# EAGLE board MA-DAQ (EAGLE 5.11), part 1 of 2
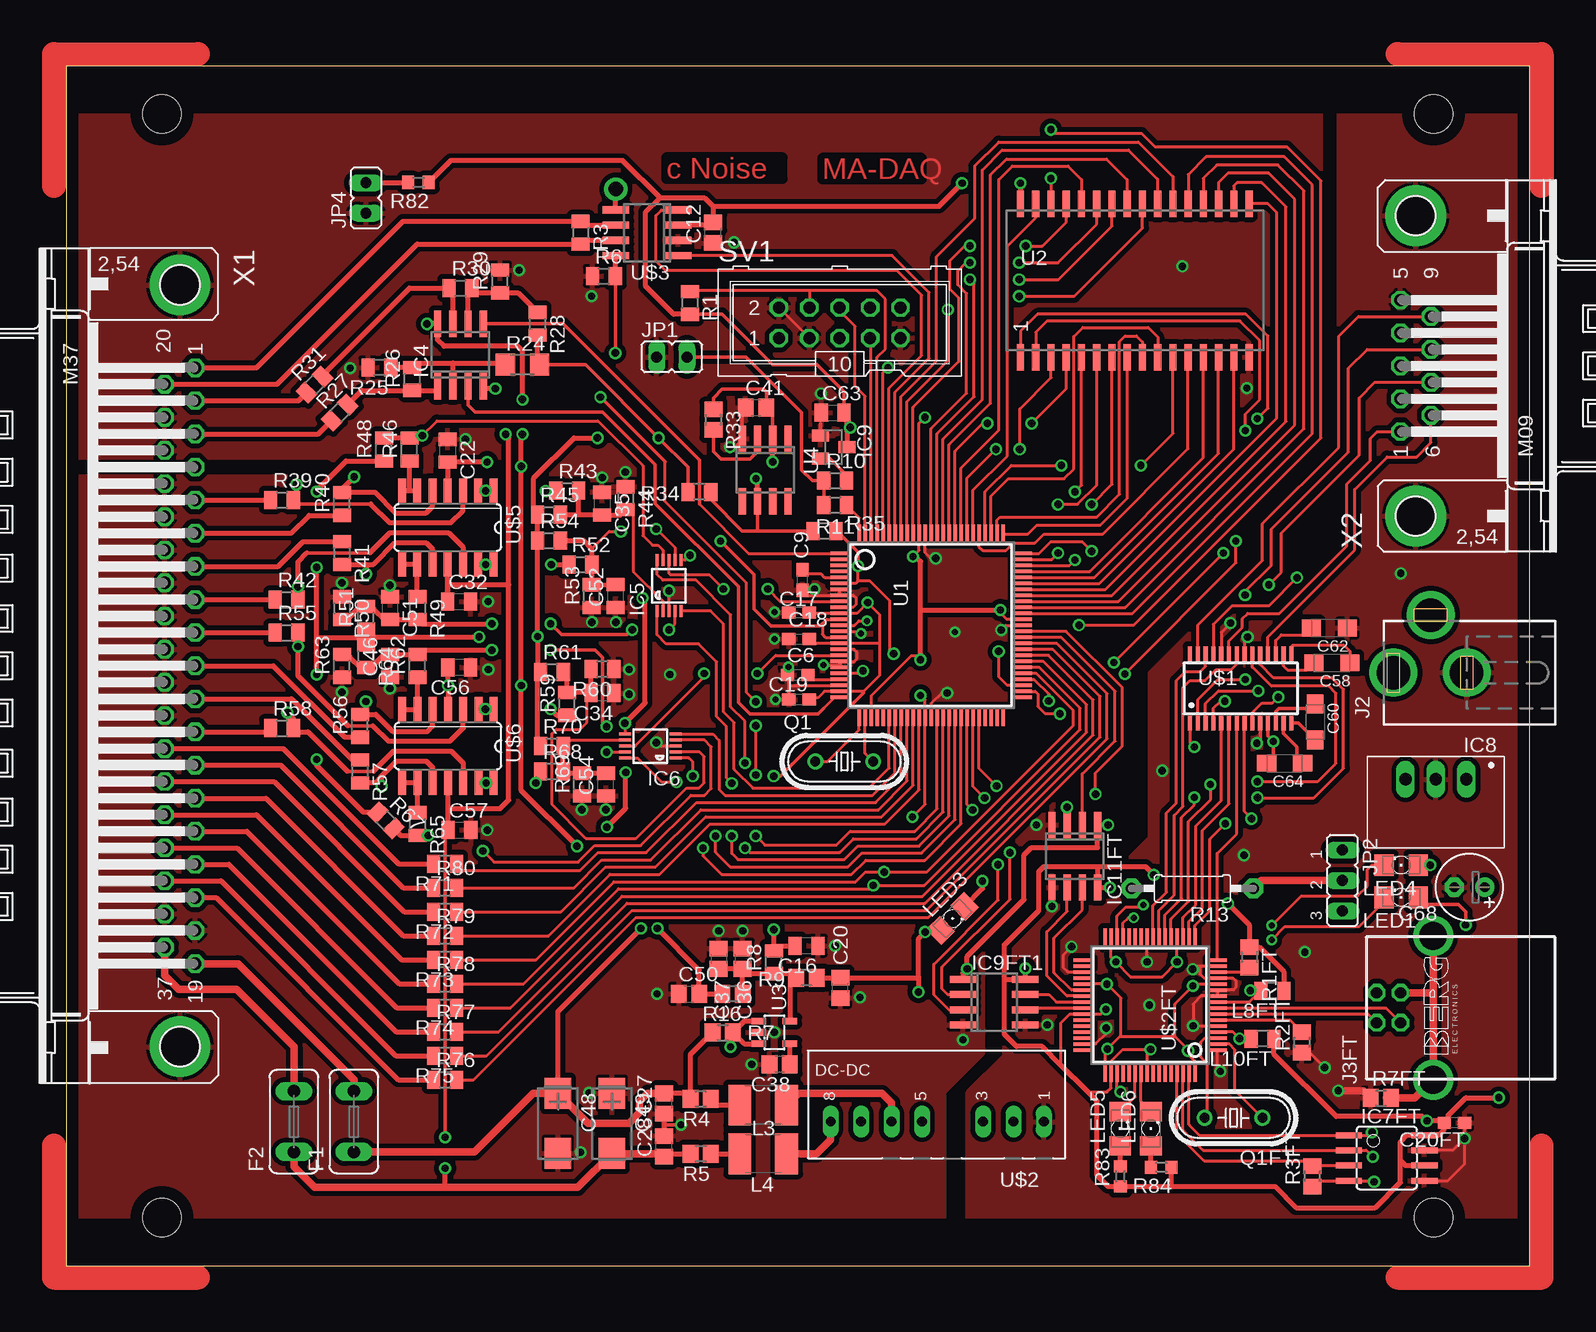
[diagram p5: board, top side]
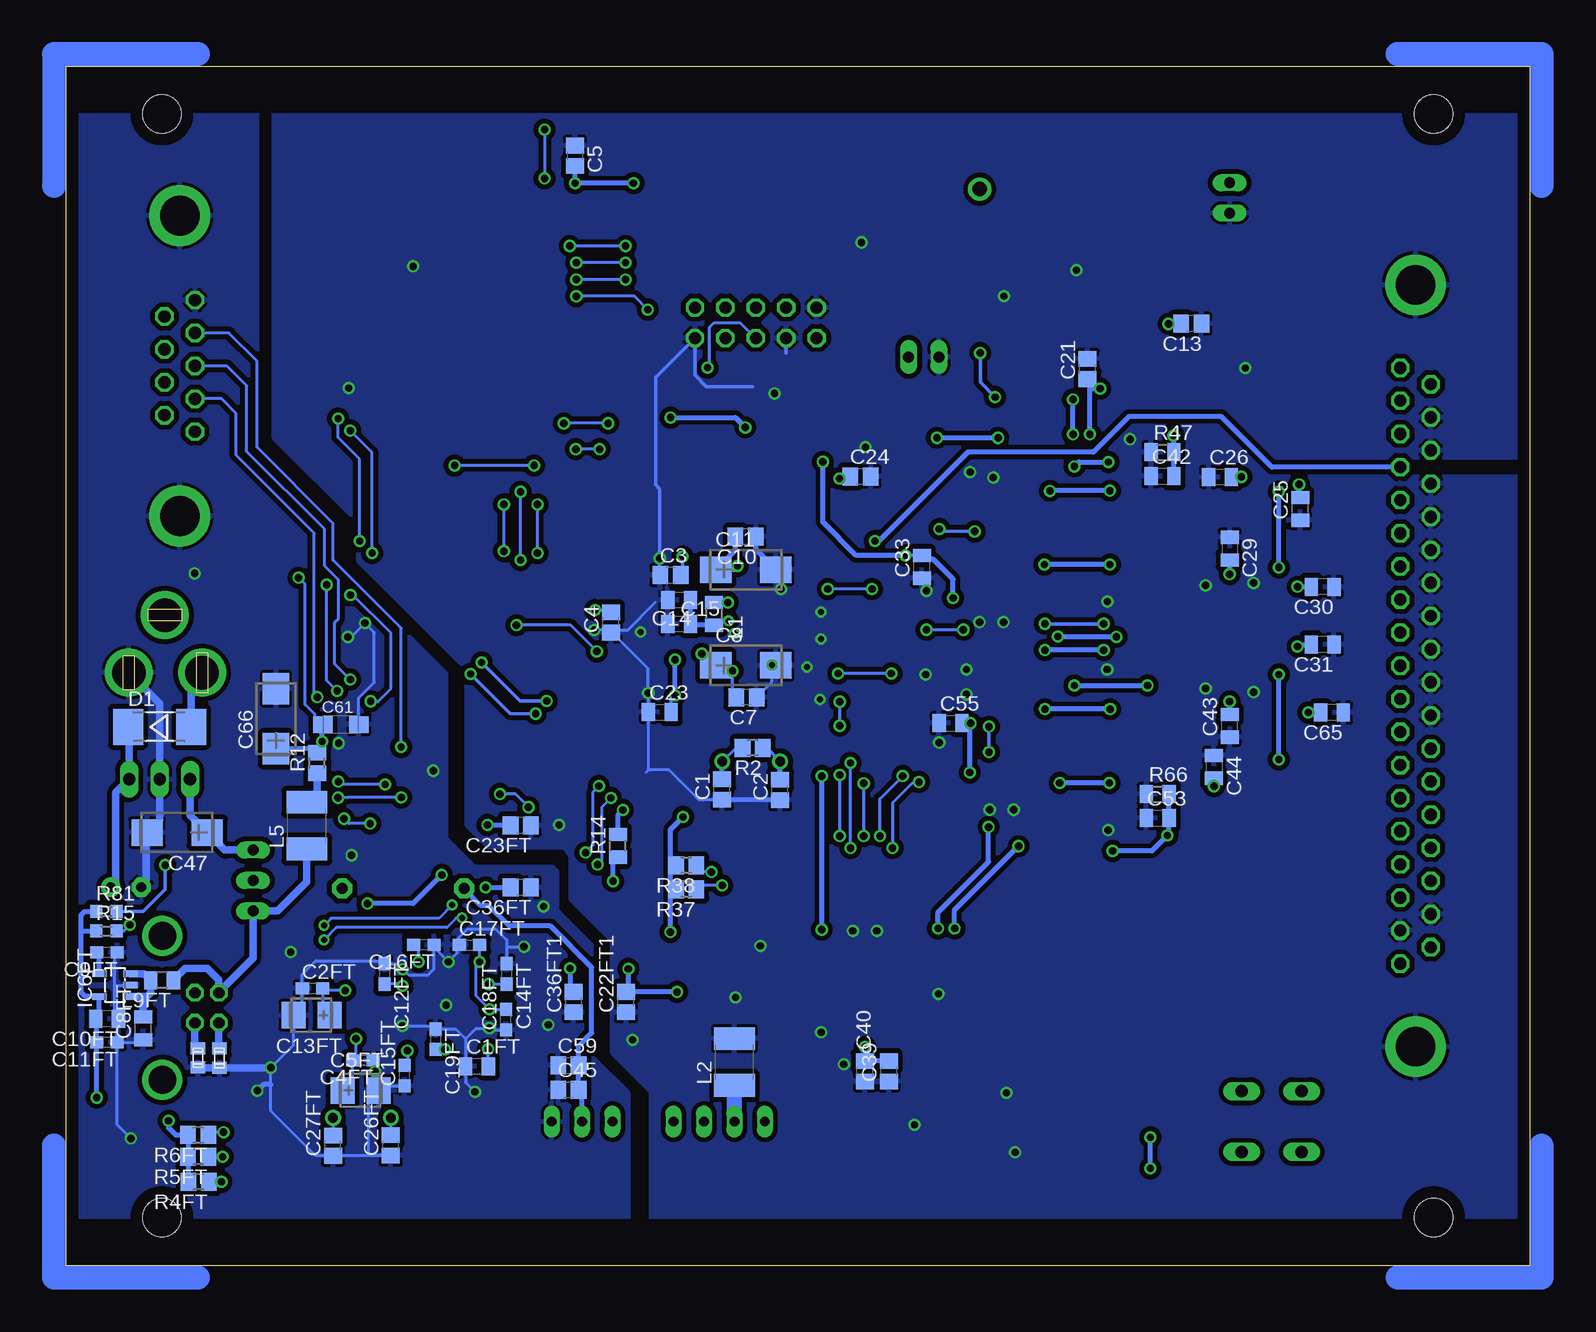
[diagram p6: board, bottom side, seen from below]

Size 122 x 100 mm. Coordinates in mm from the lower left corner, seen from the top.
Outline: 0,0 122,0 122,100 0,100 0,0
Copper layers (1*16): Top 0.035mm / dielectric 1.5mm / Bottom 0.035mm
Design rules "default *": minimum track width 10mil, minimum drill 15mil, track to track 8mil, track to pad 8mil, pad to pad 7mil, via to via 8mil, smd to smd 0mil, copper to edge 40mil, drill to drill 8mil, minimum pad ring 10mil, minimum via ring 8mil, stop-mask expansion 4mil, vias tented up to drill 0mil, thermal gap 10mil
Holes 3.2 mm at 8,4 114,4 8,96 114,96
tRestrict: area 0,0 to 122,3.5; area 0,96.5 to 122,100; 2 lines
bRestrict: area 0,0 to 122,3.5; area 0,96.5 to 122,100; 2 lines

## Footprints (pad centres in the part's own frame; a part is rotated, then mirrored left to right if it is on the bottom)
C0805 = smd 1.3 x 1.5: 1 -0.85,0; 2 0.85,0
C0805' = smd 1.1 x 1.5: 1 -0.95,0; 2 0.95,0
C0603 = smd 1.1 x 1: 1 -0.85,0; 2 0.85,0
CT3528 = smd 2 x 2.2: + -1.5,0; - 1.5,0
CT6032 = smd 2.6 x 2.2: + -2.5,0; - 2.5,0
SMC_A = smd 1.6 x 1.4: + -1.5,0; - 1.5,0
E2,5-6 = drill 0.813 pad 1.6 round: + -1.27,0 | drill 0.813 pad 1.6 octagon: - 1.27,0
MELF-MLL41 = smd 2.5 x 3: A 2.625,0; C -2.625,0
TE5 = drill 1.016 long: 1 -2.54,0; 2 2.54,0
SO08 = smd 0.6 x 2.2: 1 -1.905,-2.6; 2 -0.635,-2.6; 3 0.635,-2.6; 4 1.905,-2.6; 5 1.905,2.6; 6 0.635,2.6; 7 -0.635,2.6; 8 -1.905,2.6
MSOP10 = smd 0.25 x 1: 1 -1,-2.113; 2 -0.5,-2.113; 3 0,-2.113; 4 0.5,-2.113; 5 1,-2.113; 6 1,2.113; 7 0.5,2.113; 8 0,2.113; 9 -0.5,2.113; 10 -1,2.113
SOT23-5L = smd 0.55 x 1.2: 1 -0.95,-1.3; 2 0,-1.3; 3 0.95,-1.3; 4 0.95,1.3; 5 -0.95,1.3
SOIC8 = smd 0.5 x 2.2: 1 -1.905,-3.154; 2 -0.645,-3.154; 3 0.625,-3.154; 4 1.895,-3.154; 5 1.905,3.154; 6 0.635,3.154; 7 -0.635,3.154; 8 -1.905,3.154
R-78XX-0.5 = drill 1.016 long: GND 0,-2.54; IN -2.54,-2.54; OUT 2.54,-2.54
SOT23B-3 = smd 1 x 1.4: 1 -0.95,-1.1; 2 0.95,-1.1; 3 0,1.1
DC_POWER_JACK = drill 2.8 pad 4 round: 1 0,3.1; 2 4.8,0; 3 0,-3
USBCONNB = drill 0.95 octagon: 1 1.25,4.71; 2 -1.25,4.71; 3 -1.25,2.71; 4 1.25,2.71 | drill 2.3 round: CASE@1 -6,0; CASE@2 6,0
JP1 = drill 0.914 long: 1 0,-1.27; 2 0,1.27
JP2 = drill 0.914 long: 1 -2.54,0; 2 0,0; 3 2.54,0
R0805 = smd 1.1 x 1.5: 1 -0.95,0; 2 0.95,0
L1812 = smd 1.9 x 3.4: 1 -1.95,0; 2 1.95,0
1206 = smd 1.6 x 1.803: A -1.422,0; C 1.422,0
HC49/S = drill 0.813 round: 1 -2.413,0; 2 2.413,0
R0805' = smd 1.3 x 1.5: 1 -0.85,0; 2 0.85,0
0207/10 = drill 0.9 pad 1.676 octagon: 1 -5.08,0; 2 5.08,0
R0603 = smd 1 x 1.1: 1 -0.85,0; 2 0.85,0
R1206 = smd 1.6 x 1.803: 1 -1.422,0; 2 1.422,0
ML10 = drill 1 octagon: 1 -5.08,-1.27; 2 -5.08,1.27; 3 -2.54,-1.27; 4 -2.54,1.27; 5 0,-1.27; 6 0,1.27; 7 2.54,-1.27; 8 2.54,1.27; 9 5.08,-1.27; 10 5.08,1.27
TQFP100 = smd 0.3 x 1.6: 1 -6,-7.6; 2 -5.5,-7.6; 3 -5,-7.6; 4 -4.5,-7.6; 5 -4,-7.6; 6 -3.5,-7.6; 7 -3,-7.6; 8 -2.5,-7.6; 9 -2,-7.6; 10 -1.5,-7.6; 11 -1,-7.6; 12 -0.5,-7.6; 13 0,-7.6; 14 0.5,-7.6; 15 1,-7.6; 16 1.5,-7.6; 17 2,-7.6; 18 2.5,-7.6; 19 3,-7.6; 20 3.5,-7.6; 21 4,-7.6; 22 4.5,-7.6; 23 5,-7.6; 24 5.5,-7.6; 25 6,-7.6; 51 6,7.6; 52 5.5,7.6; 53 5,7.6; 54 4.5,7.6; 55 4,7.6; 56 3.5,7.6; 57 3,7.6; 58 2.5,7.6; 59 2,7.6; 60 1.5,7.6; 61 1,7.6; 62 0.5,7.6; 63 0,7.6; 64 -0.5,7.6; 65 -1,7.6; 66 -1.5,7.6; 67 -2,7.6; 68 -2.5,7.6; 69 -3,7.6; 70 -3.5,7.6; 71 -4,7.6; 72 -4.5,7.6; 73 -5,7.6; 74 -5.5,7.6; 75 -6,7.6 | smd 1.6 x 0.3: 26 7.6,-6; 27 7.6,-5.5; 28 7.6,-5; 29 7.6,-4.5; 30 7.6,-4; 31 7.6,-3.5; 32 7.6,-3; 33 7.6,-2.5; 34 7.6,-2; 35 7.6,-1.5; 36 7.6,-1; 37 7.6,-0.5; 38 7.6,0; 39 7.6,0.5; 40 7.6,1; 41 7.6,1.5; 42 7.6,2; 43 7.6,2.5; 44 7.6,3; 45 7.6,3.5; 46 7.6,4; 47 7.6,4.5; 48 7.6,5; 49 7.6,5.5; 50 7.6,6; 76 -7.6,6; 77 -7.6,5.5; 78 -7.6,5; 79 -7.6,4.5; 80 -7.6,4; 81 -7.6,3.5; 82 -7.6,3; 83 -7.6,2.5; 84 -7.6,2; 85 -7.6,1.5; 86 -7.6,1; 87 -7.6,0.5; 88 -7.6,0; 89 -7.6,-0.5; 90 -7.6,-1; 91 -7.6,-1.5; 92 -7.6,-2; 93 -7.6,-2.5; 94 -7.6,-3; 95 -7.6,-3.5; 96 -7.6,-4; 97 -7.6,-4.5; 98 -7.6,-5; 99 -7.6,-5.5; 100 -7.6,-6
SOP32 = smd 0.6 x 2.2: 1 -9.525,-6.4; 2 -8.255,-6.4; 3 -6.985,-6.4; 4 -5.715,-6.4; 5 -4.445,-6.4; 6 -3.175,-6.4; 7 -1.905,-6.4; 8 -0.635,-6.4; 9 0.635,-6.4; 10 1.905,-6.4; 11 3.175,-6.4; 12 4.445,-6.4; 13 5.715,-6.4; 14 6.985,-6.4; 15 8.255,-6.4; 16 9.525,-6.4; 17 9.525,6.4; 18 8.255,6.4; 19 6.985,6.4; 20 5.715,6.4; 21 4.445,6.4; 22 3.175,6.4; 23 1.905,6.4; 24 0.635,6.4; 25 -0.635,6.4; 26 -1.905,6.4; 27 -3.175,6.4; 28 -4.445,6.4; 29 -5.715,6.4; 30 -6.985,6.4; 31 -8.255,6.4; 32 -9.525,6.4
SO8 = smd 0.6 x 2.2: 1 -1.905,-2.6; 2 -0.635,-2.6; 3 0.635,-2.6; 4 1.905,-2.6; 5 1.905,2.6; 6 0.635,2.6; 7 -0.635,2.6; 8 -1.905,2.6
TSSOP28 = smd 0.35 x 1.2: 1 -4.225,-2.9; 2 -3.575,-2.9; 3 -2.925,-2.9; 4 -2.275,-2.9; 5 -1.625,-2.9; 6 -0.975,-2.9; 7 -0.325,-2.9; 8 0.325,-2.9; 9 0.975,-2.9; 10 1.625,-2.9; 11 2.275,-2.9; 12 2.925,-2.9; 13 3.575,-2.9; 14 4.225,-2.9; 15 4.225,2.9; 16 3.575,2.9; 17 2.925,2.9; 18 2.275,2.9; 19 1.625,2.9; 20 0.975,2.9; 21 0.325,2.9; 22 -0.325,2.9; 23 -0.975,2.9; 24 -1.625,2.9; 25 -2.275,2.9; 26 -2.925,2.9; 27 -3.575,2.9; 28 -4.225,2.9
PGB1010603 = smd 1 x 1.2: P$1 -0.8,0; P$2 0.8,0
TMR2P = drill 0.813 long: 1 0,0; 2 2.54,0; 3 5.08,0; 5 10.16,0; 6 12.7,0; 7 15.24,0; 8 17.78,0
SQFP-S-10X10-64 = smd 0.3 x 1.6: 1 -3.75,-5.6; 2 -3.25,-5.6; 3 -2.75,-5.6; 4 -2.25,-5.6; 5 -1.75,-5.6; 6 -1.25,-5.6; 7 -0.75,-5.6; 8 -0.25,-5.6; 9 0.25,-5.6; 10 0.75,-5.6; 11 1.25,-5.6; 12 1.75,-5.6; 13 2.25,-5.6; 14 2.75,-5.6; 15 3.25,-5.6; 16 3.75,-5.6; 33 3.75,5.6; 34 3.25,5.6; 35 2.75,5.6; 36 2.25,5.6; 37 1.75,5.6; 38 1.25,5.6; 39 0.75,5.6; 40 0.25,5.6; 41 -0.25,5.6; 42 -0.75,5.6; 43 -1.25,5.6; 44 -1.75,5.6; 45 -2.25,5.6; 46 -2.75,5.6; 47 -3.25,5.6; 48 -3.75,5.6 | smd 1.6 x 0.3: 17 5.6,-3.75; 18 5.6,-3.25; 19 5.6,-2.75; 20 5.6,-2.25; 21 5.6,-1.75; 22 5.6,-1.25; 23 5.6,-0.75; 24 5.6,-0.25; 25 5.6,0.25; 26 5.6,0.75; 27 5.6,1.25; 28 5.6,1.75; 29 5.6,2.25; 30 5.6,2.75; 31 5.6,3.25; 32 5.6,3.75; 49 -5.6,3.75; 50 -5.6,3.25; 51 -5.6,2.75; 52 -5.6,2.25; 53 -5.6,1.75; 54 -5.6,1.25; 55 -5.6,0.75; 56 -5.6,0.25; 57 -5.6,-0.25; 58 -5.6,-0.75; 59 -5.6,-1.25; 60 -5.6,-1.75; 61 -5.6,-2.25; 62 -5.6,-2.75; 63 -5.6,-3.25; 64 -5.6,-3.75
PAD_CONNECT_3 = drill 1.2 pad 1.93 round: P$1 0,0
SO14 = smd 0.66 x 2.032: 1 -3.81,-3.073; 2 -2.54,-3.073; 3 -1.27,-3.073; 4 0,-3.073; 5 1.27,-3.073; 6 2.54,-3.073; 7 3.81,-3.073; 8 3.81,3.073; 9 2.54,3.073; 10 1.27,3.073; 11 0,3.073; 12 -1.27,3.073; 13 -2.54,3.073; 14 -3.81,3.073
M37HP = drill 1.016 octagon: 1 -24.841,1.27; 2 -22.098,1.27; 3 -19.329,1.27; 4 -16.561,1.27; 5 -13.818,1.27; 6 -11.049,1.27; 7 -8.28,1.27; 8 -5.512,1.27; 9 -2.769,1.27; 10 0,1.27; 11 2.769,1.27; 12 5.512,1.27; 13 8.28,1.27; 14 11.049,1.27; 15 13.792,1.27; 16 16.561,1.27; 17 19.329,1.27; 18 22.073,1.27; 19 24.841,1.27; 20 -23.47,-1.27; 21 -20.701,-1.27; 22 -17.958,-1.27; 23 -15.189,-1.27; 24 -12.421,-1.27; 25 -9.652,-1.27; 26 -6.909,-1.27; 27 -4.14,-1.27; 28 -1.372,-1.27; 29 1.372,-1.27; 30 4.14,-1.27; 31 6.909,-1.27; 32 9.652,-1.27; 33 12.421,-1.27; 34 15.189,-1.27; 35 17.932,-1.27; 36 20.701,-1.27; 37 23.47,-1.27 | drill 3.302 pad 5.08 round: G1 -31.75,0; G2 31.75,0
M09HP = drill 1.016 octagon: 1 -5.486,1.27; 2 -2.743,1.27; 3 0,1.27; 4 2.743,1.27; 5 5.486,1.27; 6 -4.115,-1.27; 7 -1.372,-1.27; 8 1.372,-1.27; 9 4.115,-1.27 | drill 3.302 pad 5.08 round: G1 -12.522,0; G2 12.522,0

## Placement (x,y rotation side)
C1  33p  [C0805]  67.3,39.68 90 bottom
C1FT  3u3  [C0805']  87.75,16.62 0 bottom
C2  33p  [C0805]  62.47,39.65 90 bottom
C2FT  100n  [C0603]  101.45,23.12 0 bottom
C3  100n  [C0805]  71.61,57.56 0 bottom
C4  100n  [C0805]  76.56,53.62 90 bottom
C4FT  100n  [C0603]  97.25,17.12 180 bottom
C5  100n  [C0805]  79.58,92.51 270 bottom
C5FT  4u7  [CT3528]  97.45,14.6 0 bottom
C6  100n  [C0603]  61,49.25 0 top
C7  100n  [C0805]  65.27,47.38 180 bottom
C8  47uF  [CT6032]  65.33,50.03 0 bottom
C8FT  10u  [C0805']  115.56,19.77 90 bottom
C9  100n  [C0603]  61.4,57.15 90 top
C9FT  10n  [C0603]  118.58,26.1 180 bottom
C10  100n  [C0805]  65.34,60.75 180 bottom
C10FT  10u  [C0805']  118.58,20.57 180 bottom
C11  47uF  [CT6032]  65.33,58.01 0 bottom
C11FT  100n  [C0603]  118.58,18.61 180 bottom
C12  100n  [C0805]  53.94,86.1 90 top
C12FT  100n  [C0603]  95.45,24.31 270 bottom
C13  100n  [C0805]  28.2,78.51 180 bottom
C13FT  4u7  [CT3528]  101.54,20.87 180 bottom
C14  100n  [C0805']  70.89,55.5 0 bottom
C14FT  100n  [C0603]  85.27,24.31 270 bottom
C15  1uF  [C0805']  70.89,53.5 0 bottom
C15FT  100n  [C0603]  93.77,15.84 90 bottom
C16  1uF  [C0805']  61.73,26.66 180 top
C16FT  100n  [C0603]  92.17,26.74 180 bottom
C17  100n  [C0603]  61.1,54.45 0 top
C17FT  100n  [C0603]  88.36,26.72 0 bottom
C18  100n  [C0603]  61.1,52.23 0 top
C18FT  100n  [C0603]  85.33,20.5 90 bottom
C19  100n  [C0603]  61.1,47.2 0 top
C19FT  100n  [C0603]  91.2,18.86 270 bottom
C20  1uF  [C0805]  64.55,23.15 90 top
C20FT  100n  [C0603]  115.74,11.91 180 top
C21  100n  [C0805]  36.84,74.75 90 bottom
C22  100n  [C0805']  31.81,67.93 270 top
C22FT1  100n  [C0805]  75.32,21.96 90 bottom
C23  100n  [C0805']  72.5,46.13 0 bottom
C23FT  100n  [C0805]  84.09,36.7 180 bottom
C24  1u  [C0805]  55.76,65.79 0 bottom
C25  [C0805']  19.11,63.08 90 bottom
C26  [C0805']  25.8,65.75 0 bottom
C26FT  33p  [C0805]  94.92,10.02 90 bottom
C27  4u7  [C0805]  49.87,13.5 90 top
C27FT  33p  [C0805]  99.75,10 90 bottom
C28  4u7  [C0805]  49.87,9.95 90 top
C29  [C0805']  25,59.76 270 bottom
C30  [C0805']  17.25,56.58 180 bottom
C31  [C0805']  17.25,51.78 180 bottom
C32  100n  [C0805']  32.77,55.35 0 top
C33  [C0805']  50.65,58.25 90 bottom
C34  [C0805']  44.72,47.71 180 top
C35  [C0805']  44.69,63.51 270 top
C36  4u7  [C0805]  56.41,25.58 270 top
C36FT  100n  [C0805]  84.09,31.53 180 bottom
C36FT1  100n  [C0805]  79.67,21.96 90 bottom
C37  100n  [C0805]  54.41,25.58 270 top
C38  10n  [C0805]  59.5,16.77 180 top
C39  4u7  [C0805]  53.4,16.2 90 bottom
C40  100n  [C0805]  55.4,16.2 90 bottom
C41  100n  [C0805]  57.52,71.53 0 top
C42  [C0805']  30.6,65.8 0 bottom
C43  [C0805']  25,45 90 bottom
C44  [C0805']  26.3,41.57 270 bottom
C45  100n  [C0805]  80.12,14.66 0 bottom
C46  [C0805']  27,50 90 top
C47  22u  [CT6032]  112.73,36.1 180 bottom
C48  47uF  [CT6032]  41,11.85 270 top
C49  47uF  [CT6032]  45.5,11.85 270 top
C50  10u  [C0805]  51.94,22.65 0 top
C51  [C0805']  27,54.8 270 top
C52  [C0805']  45.83,55.81 90 top
C53  [C0805']  31,37.3 0 bottom
C54  [C0805']  45,40.1 90 top
C55  [C0805']  48.26,45.21 0 bottom
C56  100n  [C0805']  32.79,49.86 180 top
C57  100n  [C0805']  32.8,36.3 0 top
C58  100n  [SMC_A]  105.51,50.25 180 top
C59  4u7  [C0805]  80.12,16.69 0 bottom
C60  100n  [SMC_A]  104.13,45.32 270 top
C61  100n  [SMC_A]  99.09,45.09 0 bottom
C62  100n  [SMC_A]  105.3,53.15 180 top
C63  100n  [C0805']  63.91,71.08 0 top
C64  100n  [SMC_A]  101.58,41.87 180 top
C65  [C0805']  16.46,46.1 180 bottom
C66  47uF  [CT6032]  104.5,45.58 90 bottom
C68  22u  [E2,5-6]  116.99,31.54 180 top
D1  DMELF  [MELF-MLL41]  114.2,44.91 0 bottom
F1  [TE5]  24,12 90 top
F2  [TE5]  19,12 90 top
IC4  OPA_DUALSO08  [SO08]  32.88,75.91 0 top
IC5  ADG704  [MSOP10]  50.26,56.68 0 top
IC6  ADG704  [MSOP10]  48.7,43.3 90 top
IC6FT  LP2985AIM  [SOT23-5L]  117.91,23.37 90 bottom
IC7FT  AT93C46A-10SQ-2.7  [SOIC8]  110.09,8.97 270 top
IC8  R-785.0  [R-78XX-0.5]  114.2,38 180 top
IC9  LM809-3V  [SOT23B-3]  63.99,68.23 270 top
IC9FT1  ADUM1201BR  [SO08]  77.37,21.96 270 top
IC11FT  ADUM1201BR  [SO08]  84.09,34.12 180 top
J2  DC_POWER_JACK  [DC_POWER_JACK]  113.76,49.42 90 top
J3FT  USB-B  [USBCONNB]  113.97,21.48 90 top
JP1  [JP1]  50.5,75.74 270 top
JP2  [JP2]  106.4,32.09 270 top
JP4  [JP1]  25,89 0 top
L1  [R0805]  68,54.32 270 bottom
L2  [L1812]  66.27,16.97 90 bottom
L3  [L1812]  58.12,13.38 180 top
L4  [L1812]  58.12,9.31 180 top
L5  [L1812]  101.92,36.67 90 bottom
L8FT  [R0805]  100.56,22.91 180 top
L9FT  [R0805]  114,23.79 180 bottom
L10FT  [R0805]  99.74,18.91 180 top
LED1  ARX  [1206]  111.3,30.69 180 top
LED3  [1206]  73.92,28.93 45 top
LED4  ATX  [1206]  111.3,33.38 180 top
LED5  BRX  [1206]  87.89,11.41 90 top
LED6  BTX  [1206]  90.44,11.41 90 top
Q1  24MHz  [HC49/S]  64.88,42.02 0 top
Q1FT  [HC49/S]  97.33,12.31 180 top
R1  4k7  [R0805]  52,80.25 270 top
R1FT  1k  [R0805']  98.64,25.7 270 top
R2  10M  [R0805']  64.75,43.16 180 bottom
R2FT  12k  [R0805']  103.04,18.61 90 top
R3  120R  [R0805]  42.91,86.1 270 top
R3FT  2k2  [R0805']  103.9,7.45 90 top
R4  2R  [R0805']  52.92,13.88 180 top
R4FT  10k  [R0805']  110.95,6.97 180 bottom
R5  2R  [R0805']  52.92,9.31 180 top
R5FT  10k  [R0805']  110.97,9.06 180 bottom
R6  0R  [R0805]  44.84,82.48 0 top
R6FT  10k  [R0805']  110.97,10.88 180 bottom
R7  2R  [R0805']  54.74,19.42 0 top
R7FT  0R  [R0805']  109.6,13.96 0 top
R8  2R  [R0805]  59,25.29 90 top
R9  2R  [R0805']  61.73,24 180 top
R10  330R  [R0805]  64.12,65.43 0 top
R11  1k  [R0805]  64.12,63.4 0 top
R12  2R  [R0805']  101.06,41.89 90 bottom
R13  1R  [0207/10]  93.9,31.43 180 top
R14  330R  [R0805]  76,35 90 bottom
R15  1k  [R0603]  118.64,27.89 0 bottom
R16  0R  [R0805']  55.56,22.65 180 top
R24  5k  [R1206]  38.05,75.1 0 top
R25  10k  [R0805]  26.13,74.86 180 top
R26  10k  [R0805]  28.87,73.9 90 top
R27  50R  [R0805]  22.82,71.11 45 top
R28  5k  [R0805]  39.3,78.51 270 top
R29  10k  [R0805]  36.18,82.04 90 top
R30  10k  [R0805]  32.88,81.49 0 top
R31  50R  [R0805]  20.72,73.44 45 top
R33  3k3  [R0805']  53.96,70.51 270 top
R34  0R  [R0805]  52.8,64.5 180 top
R35  0R  [R0805]  63.23,61.24 0 top
R37  [R0805']  70.3,31.35 180 bottom
R38  [R0805']  70.3,33.35 180 bottom
R39  10k  [R0805]  18,63.82 0 top
R40  10k  [R0805]  23,63.5 90 top
R41  10k  [R0805]  23,59.4 270 top
R42  10k  [R0805]  18.39,55.51 0 top
R43  20k  [R0805]  41.79,64.58 0 top
R44  20k  [R0805]  46.66,63.97 270 top
R45  10k  [R0805]  40.26,62.6 0 top
R46  20k  [R0805]  28.63,68.02 90 top
R47  20k  [R0805]  30.6,67.8 0 bottom
R48  10k  [R0805]  26.5,68.02 90 top
R49  20k  [R0805]  29.3,54.8 270 top
R50  20k  [R0805]  23,54.8 270 top
R51  10k  [R0805]  25,54 90 top
R52  20k  [R0805]  42.88,58.45 0 top
R53  20k  [R0805]  43.83,55.8 90 top
R54  10k  [R0805]  40.26,60.45 0 top
R55  10k  [R0805]  18.39,52.76 0 top
R56  10k  [R0805]  24.5,45 90 top
R57  10k  [R0805]  24.5,41.19 270 top
R58  10k  [R0805]  18,44.8 0 top
R59  20k  [R0805]  41.78,46.82 90 top
R60  20k  [R0805]  44.71,49.71 180 top
R61  10k  [R0805]  40.5,49.5 0 top
R62  20k  [R0805]  29.3,50 90 top
R63  20k  [R0805]  23,50 90 top
R64  10k  [R0805]  25,50.8 270 top
R65  20k  [R0805]  29.3,36.8 270 top
R66  20k  [R0805]  31,39.3 0 bottom
R67  10k  [R0805]  26.65,37.11 315 top
R68  20k  [R0805]  40.5,41.2 0 top
R69  20k  [R0805]  43,40.1 90 top
R70  10k  [R0805]  40.5,43.3 0 top
R71  50R  [R0805]  31.6,33.5 180 top
R72  50R  [R0805]  31.6,29.5 180 top
R73  50R  [R0805]  31.6,25.5 180 top
R74  50R  [R0805]  31.6,21.5 180 top
R75  50R  [R0805]  31.6,17.5 180 top
R76  50R  [R0805]  31.6,15.5 0 top
R77  50R  [R0805]  31.6,19.5 0 top
R78  50R  [R0805]  31.6,23.5 0 top
R79  50R  [R0805]  31.6,27.5 0 top
R80  50R  [R0805]  31.6,31.5 0 top
R81  1k  [R0603]  118.64,29.52 0 bottom
R82  1k  [R0603]  29.39,90.29 180 top
R83  1k  [R0603]  87.89,7.44 90 top
R84  1k  [R0603]  91.3,8.19 180 top
SV1  [ML10]  64.5,78.6 0 top
U1  C8051F060  [TQFP100]  72.12,53.37 270 top
U2  BS62LV4006  [SOP32]  89.1,82.11 0 top
U3  LP2985  [SOT23-5L]  59.05,19.43 270 top
U4  REF192GS  [SO8]  58.28,66.32 180 top
U$1  ADM211  [TSSOP28]  97.92,48.11 0 top
U$1FT  PGB1010603  [PGB1010603]  109.2,17.3 90 bottom
U$2  TMR2D  [TMR2P]  81.52,12 180 top
U$2FT  FT2232HL  [SQFP-S-10X10-64]  90.37,21.71 90 top
U$3  SN65HVD230  [SO08]  48.44,86.1 90 top
U$4  PAD_CONNECT_3  [PAD_CONNECT_3]  45.83,89.74 180 top
U$4FT  PGB1010603  [PGB1010603]  111,17.31 90 bottom
U$5  LMC6484  [SO14]  31.82,61.52 180 top
U$6  LMC6484  [SO14]  31.84,43.3 180 top
X1  [M37HP]  9.5,50 270 top
X2  [M09HP]  112.52,75 90 top